# Altium schematic sheet УШЯИ.411522.033Э3_4.SchDoc
size 420 x 297 mm; SheetNumber: 4; SheetTotal: 5
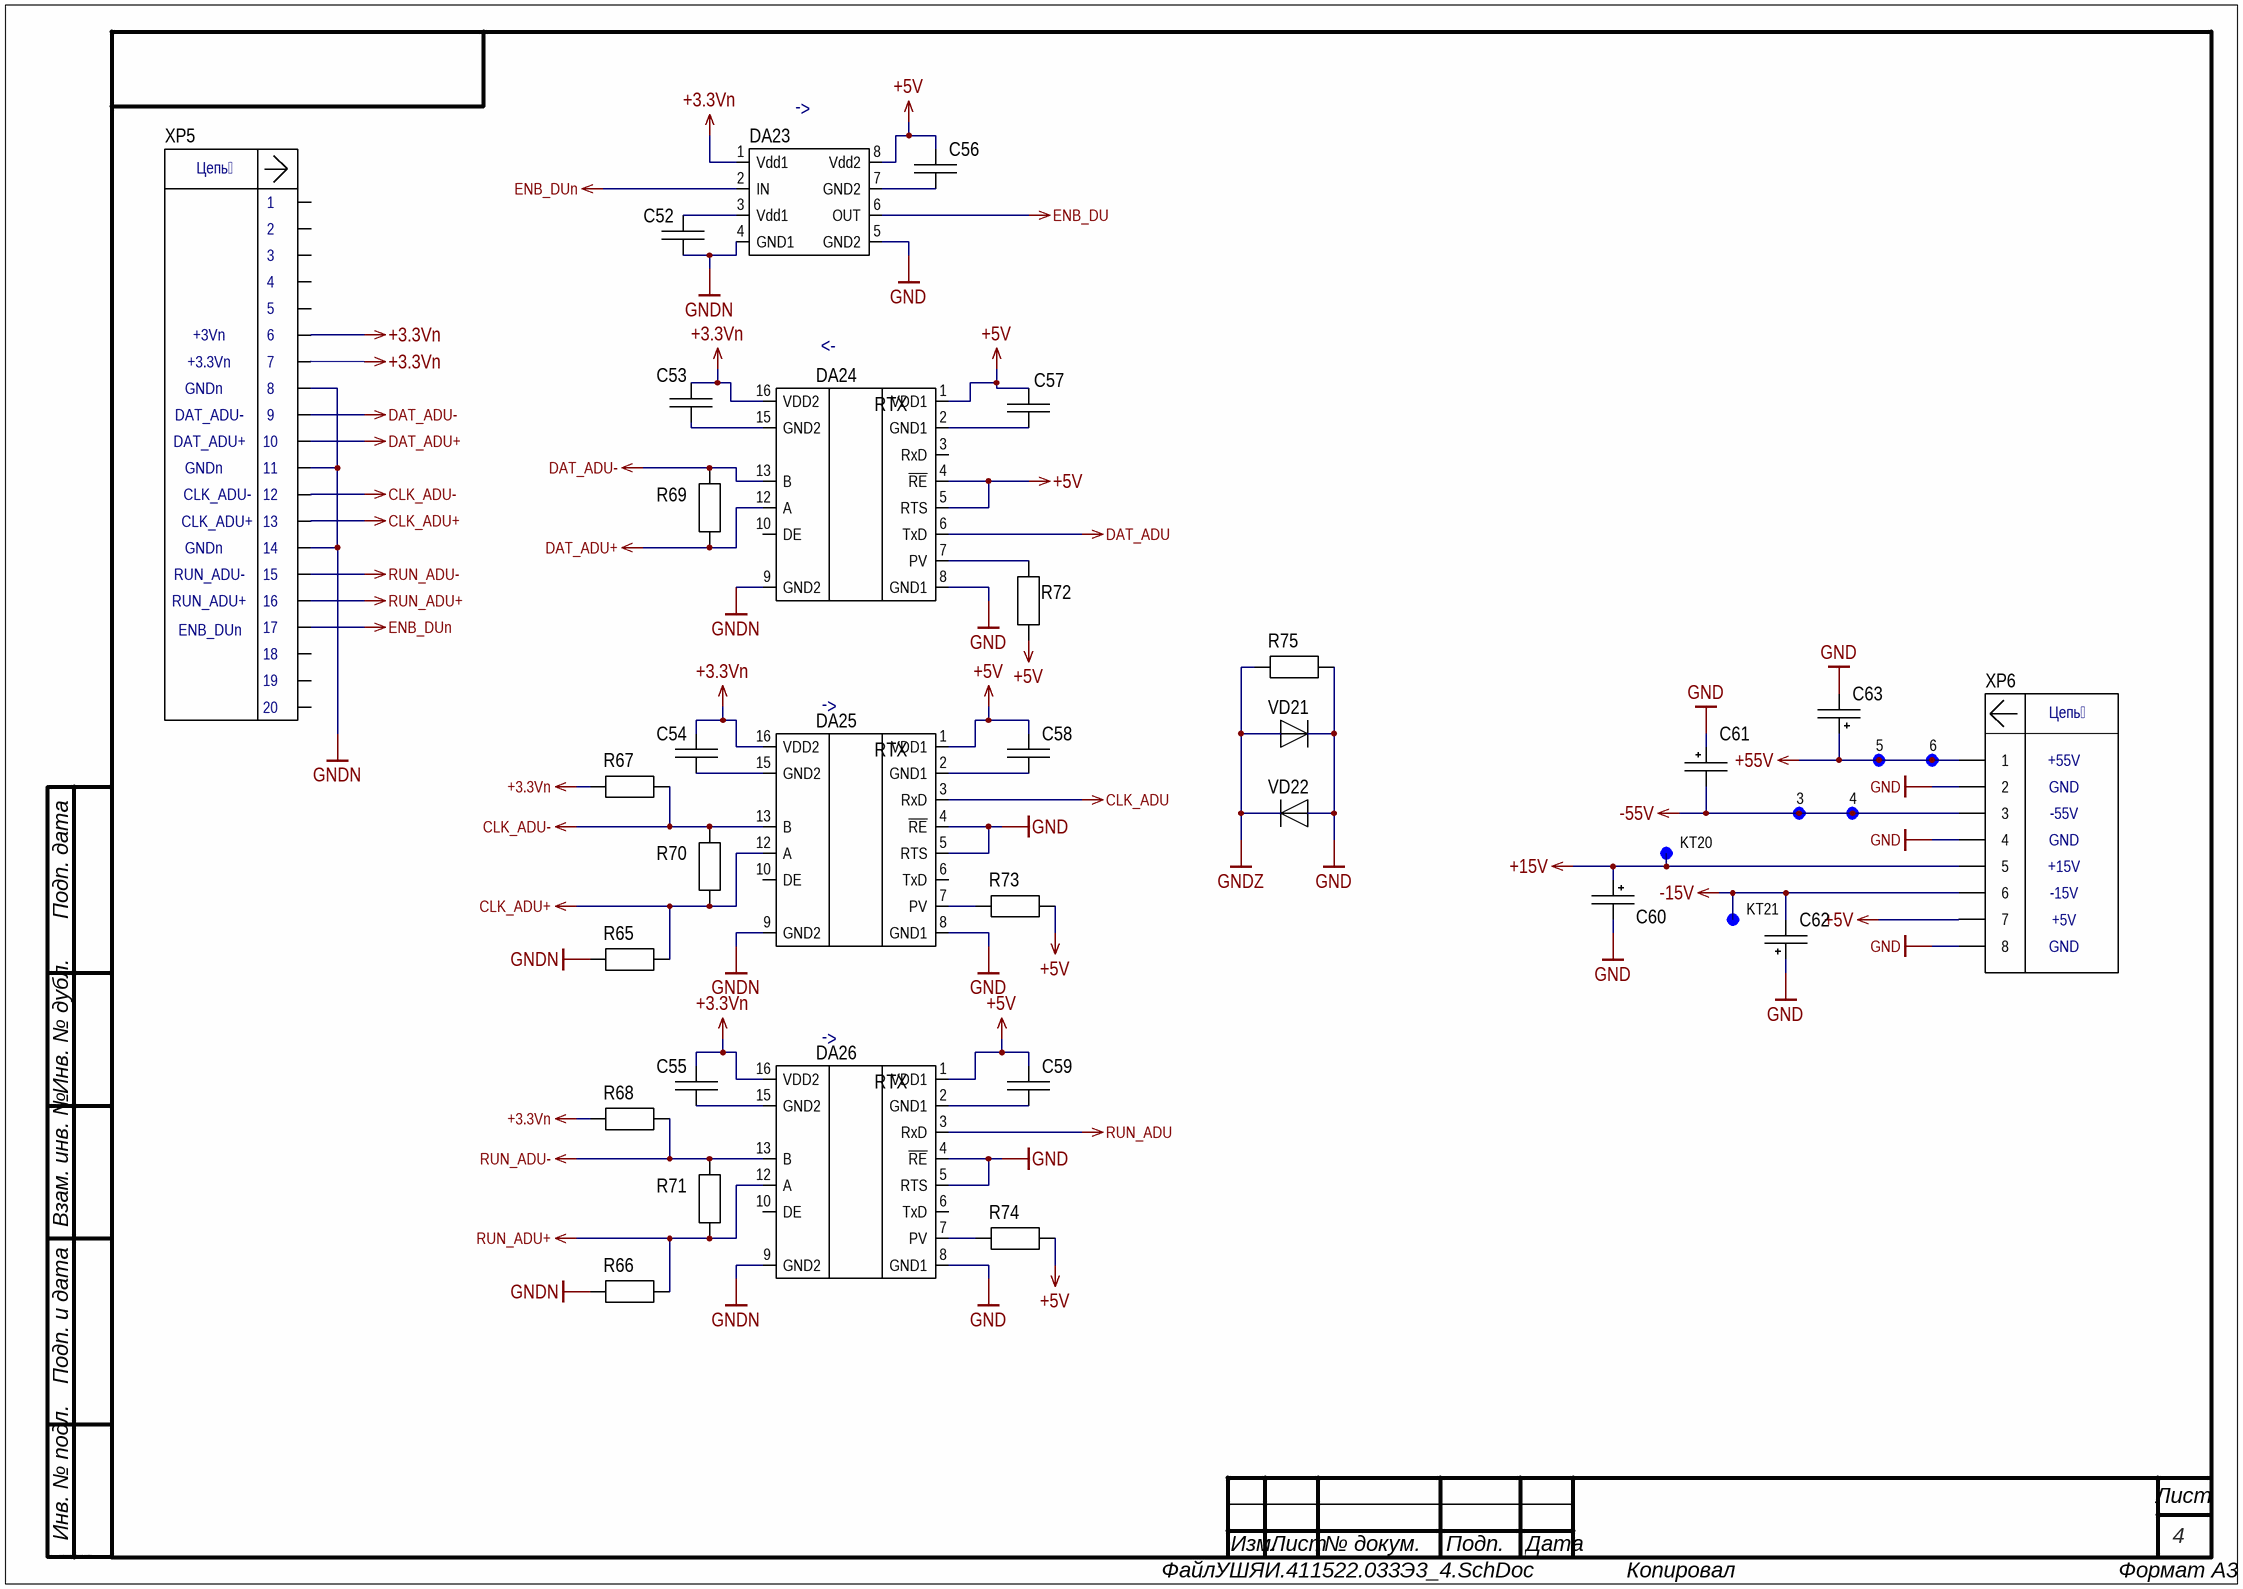
[diagram p0: УШЯИ.411522.033Э3_4.SchDoc]

## Parts
3  OTV10  [OTV10]  (value not drawn)  (no BOM)
4  OTV10  [OTV10]  (value not drawn)  (no BOM)
5  OTV10  [OTV10]  (value not drawn)  (no BOM)
6  OTV10  [OTV10]  (value not drawn)  (no BOM)
C52  0805-X7R-25 В-0,1 мкФ +-10%  [CAP: 0805]  (value not drawn)
C53  0805-X7R-25 В-0,1 мкФ +-10%  [CAP: 0805]  (value not drawn)
C54  0805-X7R-25 В-0,1 мкФ +-10%  [CAP: 0805]  (value not drawn)
C55  0805-X7R-25 В-0,1 мкФ +-10%  [CAP: 0805]  (value not drawn)
C56  0805-X7R-25 В-0,1 мкФ +-10%  [CAP: 0805]  (value not drawn)
C57  0805-X7R-25 В-0,1 мкФ +-10%  [CAP: 0805]  (value not drawn)
C58  0805-X7R-25 В-0,1 мкФ +-10%  [CAP: 0805]  (value not drawn)
C59  0805-X7R-25 В-0,1 мкФ +-10%  [CAP: 0805]  (value not drawn)
C60  ECR-35В-4,7 мкФ  [CAP TH ALUM ELEC D5.00mm S2.00mm H11.00mm]  (value not drawn)
C61  ECR-100В-2,2 мкФ  [CAP TH ALUM ELEC D5.00mm S2.00mm H11.00mm]  (value not drawn)
C62  ECR-35В-4,7 мкФ  [CAP TH ALUM ELEC D5.00mm S2.00mm H11.00mm]  (value not drawn)
C63  ECR-100В-2,2 мкФ  [CAP TH ALUM ELEC D5.00mm S2.00mm H11.00mm]  (value not drawn)
DA23  ADuM1100AR  [8-SOIC]  (value not drawn)
DA24  ADM2486BRWZ  [16-SOIC-W]  (value not drawn)
DA25  ADM2486BRWZ  [16-SOIC-W]  (value not drawn)
DA26  ADM2486BRWZ  [16-SOIC-W]  (value not drawn)
KT20  OTV10  [OTV10]  (value not drawn)  (no BOM)
KT21  OTV10  [OTV10]  (value not drawn)  (no BOM)
R65  1206-1 кОм+-5%  [1206]  (value not drawn)
R66  1206-1 кОм+-5%  [1206]  (value not drawn)
R67  1206-1 кОм+-5%  [1206]  (value not drawn)
R68  1206-1 кОм+-5%  [1206]  (value not drawn)
R69  1206-100 Ом+-5%  [1206]  (value not drawn)
R70  1206-100 Ом+-5%  [1206]  (value not drawn)
R71  1206-100 Ом+-5%  [1206]  (value not drawn)
R72  1206-12 кОм+-5%  [1206]  (value not drawn)
R73  1206-12 кОм+-5%  [1206]  (value not drawn)
R74  1206-12 кОм+-5%  [1206]  (value not drawn)
R75  1206-240 Ом+-5%  [1206]  (value not drawn)
VD21  1N4148WS  [SOD-323F]  (value not drawn)
VD22  1N4148WS  [SOD-323F]  (value not drawn)
XP5  BH2-20  [DS1014-20S]  (value not drawn)
XP6  280373-2  [280373-2]  (value not drawn)

## Nets
+3.3Vn: C53.2 C54.2 C55.2 DA23.1(Vdd1) DA24.16(VDD2) DA25.16(VDD2) DA26.16(VDD2) R67.2 R68.2 XP5.6 XP5.7
+5V: C56.1 C57.2 C58.2 C59.2 DA23.8(Vdd2) DA24.1(VDD1) DA24.4(~{RE}) DA24.5(RTS) DA25.1(VDD1) DA26.1(VDD1) R72.1 R73.1 R74.1 XP6.7
+15V: C60.1 KT20.1 XP6.5
+55V: 5.?1 6.?1 C63.1 XP6.1
-15V: C62.2 KT21.1 XP6.6
-55V: 3.?1 4.?1 C61.2 XP6.3
CLK_ADU: DA25.3(RxD)
CLK_ADU+: DA25.12(A) R65.2 R70.1 XP5.13
CLK_ADU-: DA25.13(B) R67.1 R70.2 XP5.12
DAT_ADU: DA24.6(TxD)
DAT_ADU+: DA24.12(A) R69.1 XP5.10
DAT_ADU-: DA24.13(B) R69.2 XP5.9
ENB_DU: DA23.6(OUT)
ENB_DUn: DA23.2(IN) XP5.17
GND: C60.2 C61.1 C62.1 C63.2 DA23.5(GND2) DA24.8(GND1) DA25.4(~{RE}) DA25.5(RTS) DA25.8(GND1) DA26.4(~{RE}) DA26.5(RTS) DA26.8(GND1) R75.2 VD21.1 VD22.2 XP6.2 XP6.4 XP6.8
GNDN: C52.1 DA23.4(GND1) DA24.9(GND2) DA25.9(GND2) DA26.9(GND2) R65.1 R66.1 XP5.8 XP5.11 XP5.14
GNDZ: R75.1 VD21.2 VD22.1
RUN_ADU: DA26.3(RxD)
RUN_ADU+: DA26.12(A) R66.2 R71.1 XP5.16
RUN_ADU-: DA26.13(B) R68.1 R71.2 XP5.15
NetC52_2: C52.2 DA23.3(Vdd1)
NetC53_1: C53.1 DA24.15(GND2)
NetC54_1: C54.1 DA25.15(GND2)
NetC55_1: C55.1 DA26.15(GND2)
NetC56_2: C56.2 DA23.7(GND2)
NetC57_1: C57.1 DA24.2(GND1)
NetC58_1: C58.1 DA25.2(GND1)
NetC59_1: C59.1 DA26.2(GND1)
NetDA24_7: DA24.7(PV) R72.2
NetDA25_7: DA25.7(PV) R73.2
NetDA26_7: DA26.7(PV) R74.2

Not connected (* = marked no-connect by the designer): DA24 3(RxD) 10(DE); DA25 6(TxD) 10(DE); DA26 6(TxD) 10(DE); XP5 1 2 3 4 5 18 19 20

## Notes on the sheet
- (near DA23) <-
- (near XP5) 1
- (near XP5) 2
- (near XP5) 3
- +3Vn
- (near XP5) 4
- (near XP5) 5
- (near XP5) 6
- GNDn
- +3.3Vn
- (near XP5) 7
- (near XP5) 8
- (near DA24) <-
- (near XP5) DAT_ADU-
- (near XP5) DAT_ADU+
- (near XP5) 9
- (near XP5) 10
- (near XP5) 11
- (near XP5) CLK_ADU-
- (near XP5) CLK_ADU+
- (near XP5) 12
- (near XP5) 13
- (near XP5) RUN_ADU-
- (near XP5) RUN_ADU+
- (near XP5) 14
- (near XP5) 15
- (near XP5) 16
- ENB_DUn
- (near XP5) 17
- (near XP5) 18
- (near XP5) 19
- (near XP5) 20
- (near DA25) <-
- +55V
- GND
- -55V
- +15V
- -15V
- +5V
- (near DA26) <-
- Подп. дата
- Инв. № дубл.
- Взам. инв. №
- Подп. и дата
- Инв. № подл.
- Изм.
- Лист
- № докум.
- Подп.
- Дата
- ALTIUM GOSTBOM2.0 KEV
- Файл:
- Копировал
- Формат А3
- (in symbol 280373-2) Цепь
- (in symbol ADM2486BRWZ) RTX
- (in symbol BH2-20) Цепь

## Library data of the parts
C52-C59 = 0805-X7R-25 В-0,1 мкФ +-10%: Value: 0,1 мкФ
C60 C62 = ECR-35В-4,7 мкФ: Value: 4,7 мкФ
C61 C63 = ECR-100В-2,2 мкФ: Value: 2,2 мкФ
DA23 = ADuM1100AR: iCoupler Digital Isolator
DA24-DA26 = ADM2486BRWZ: Isolated RS-485 Transceiver,  20 Mbps data rate, SOIC-16-W
R65-R68 = 1206-1 кОм+-5%: Value: 1 кОм; ModelPrint: 1206
R69-R71 = 1206-100 Ом+-5%: Value: 100 Ом; ModelPrint: 1206
R72-R74 = 1206-12 кОм+-5%: Value: 12 кОм; ModelPrint: 1206
R75 = 1206-240 Ом+-5%: Value: 240 Ом; ModelPrint: 1206
VD21 VD22 = 1N4148WS: Small Signal Fast Switching Diod; Value: *
XP5 = BH2-20: pitch 2mm, 20 pin 2x10
XP6 = 280373-2: Connector